# Altium schematic sheet Sheet_esp32.SchDoc
size A3
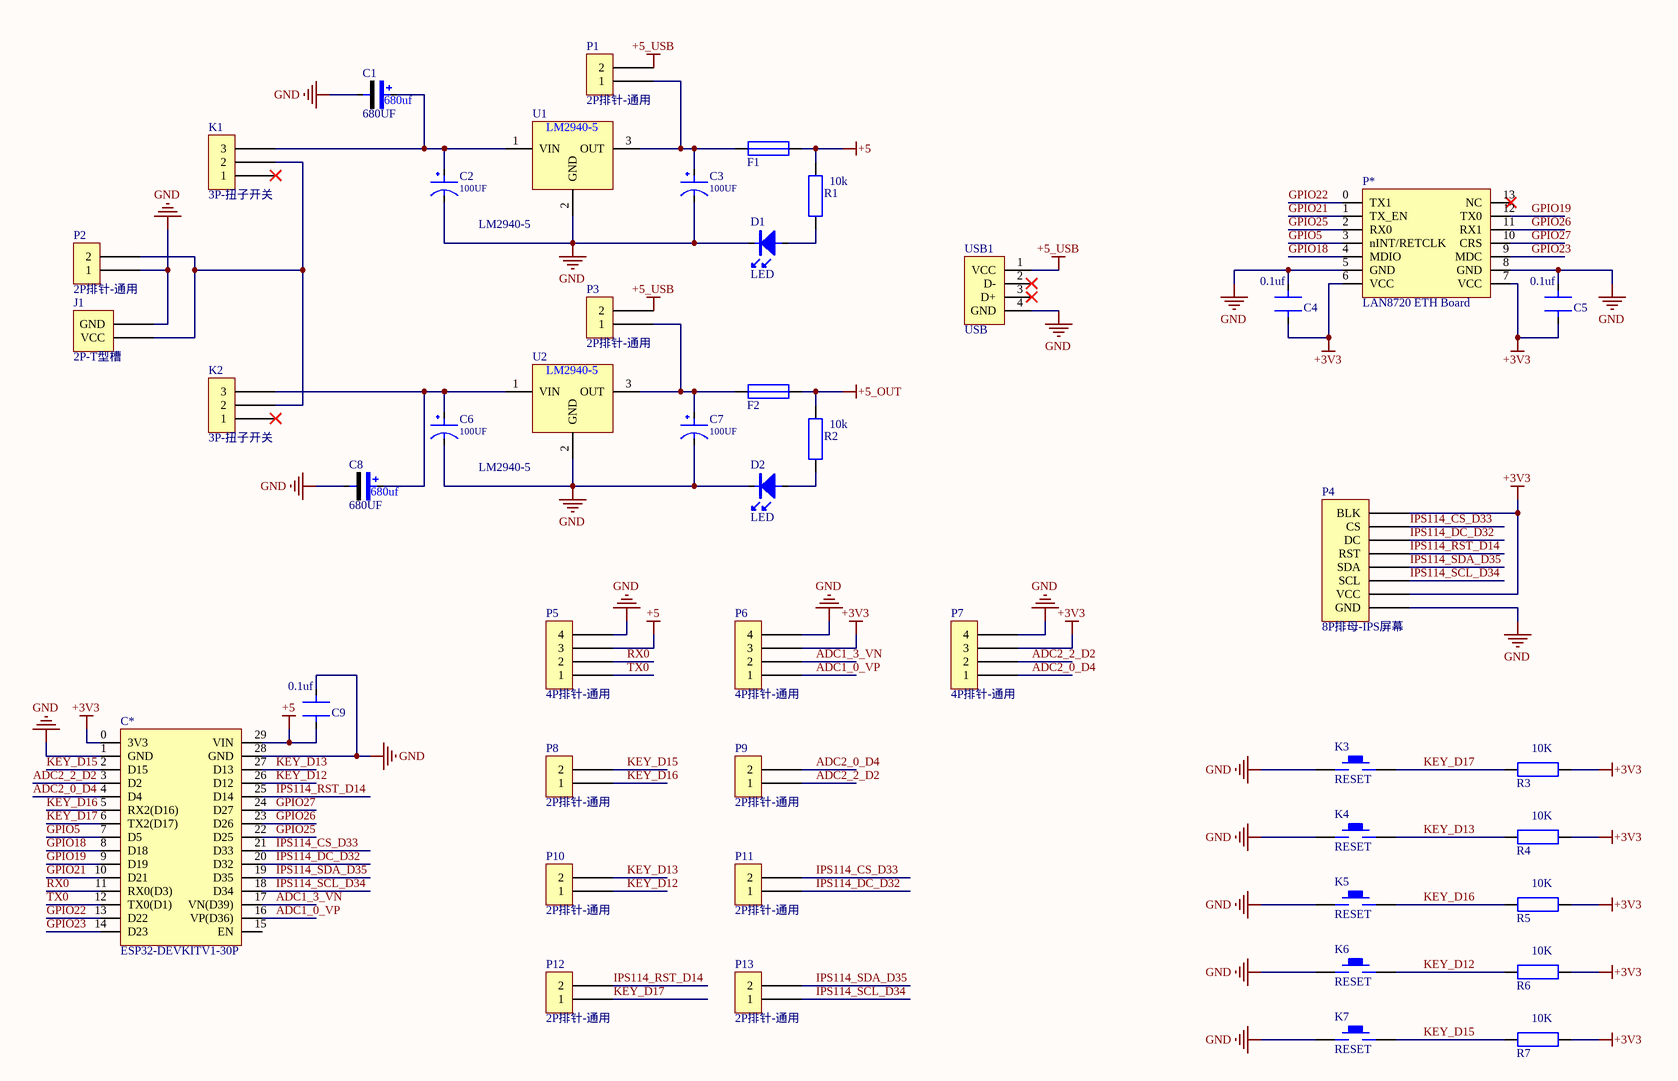
[diagram p0: Sheet_esp32.SchDoc]

## Parts
C1  680UF  [电容-直插680UF]
C2  100UF  [电容-直插680UF]
C3  100UF  [电容-直插680UF]
C4  0.1uf  [贴片0603-手工]
C5  0.1uf  [贴片0603-手工]
C6  100UF  [电容-直插680UF]
C7  100UF  [电容-直插680UF]
C8  680UF  [电容-直插680UF]
C9  0.1uf  [贴片0603-手工]
C*  ESP32-DEVKITV1-30P  [ESP32-DEVKITV1-30P]
D1  LED  [贴片0805-手工]
D2  LED  [贴片0805-手工]
F1  保险丝-通用  [贴片0805-手工]  (value not drawn)
F2  保险丝-通用  [贴片0805-手工]  (value not drawn)
J1  2P-T型槽  [T型槽-通用]
K1  3P-扭子开关  [扭子开关-直插通用]
K2  3P-扭子开关  [扭子开关-直插通用]
K3  RESET  [贴片按键-复位]
K4  RESET  [贴片按键-复位]
K5  RESET  [贴片按键-复位]
K6  RESET  [贴片按键-复位]
K7  RESET  [贴片按键-复位]
P1  2P排针-通用  [2p排针-通用]
P2  2P排针-通用  [2P-KF2EDGK插头]
P3  2P排针-通用  [2p排针-通用]
P4  8P排母-IPS屏幕  [8P排母-IPS屏幕]
P5  4P排针-通用  [4p排针-直插通用]
P6  4P排针-通用  [4p排针-直插通用]
P7  4P排针-通用  [4p排针-直插通用]
P8  2P排针-通用  [2p排针-通用]
P9  2P排针-通用  [2p排针-通用]
P10  2P排针-通用  [2p排针-通用]
P11  2P排针-通用  [2p排针-通用]
P12  2P排针-通用  [2p排针-通用]
P13  2P排针-通用  [2p排针-通用]
P*  LAN8720 ETH Board  [LAN8720 ETH Board]
R1  10k  [贴片0805-手工]
R2  10k  [贴片0805-手工]
R3  10K  [贴片0805-手工]
R4  10K  [贴片0805-手工]
R5  10K  [贴片0805-手工]
R6  10K  [贴片0805-手工]
R7  10K  [贴片0805-手工]
U1  LM2940-5  [3p排针-直插通用]
U2  LM2940-5  [3p排针-直插通用]
USB1  USB  [USB-A-F/P_B]

## Nets
+3V3: C4.1 C5.1 C*.0(3V3) P4.2(VCC) P4.8(BLK) P6.3 P7.3 P*.6(VCC) P*.7(VCC) R3.1 R4.1 R5.1 R6.1 R7.1
+5: C9.1 C*.29(VIN) F1.2 P5.3 R1.2
+5_OUT: F2.2 R2.2
+5_USB: P1.2 P3.2 USB1.1(VCC)
GND: C1.2 C2.2(GND) C3.2(GND) C4.2 C5.2 C6.2(GND) C7.2(GND) C8.2 C9.2 C*.1(GND) C*.28(GND) D1.2 D2.2 J1.2(GND) K3.1 K4.1 K5.1 K6.1 K7.1 P2.1 P4.1(GND) P5.4 P6.4 P7.4 P*.5(GND) P*.8(GND) U1.2(GND) U2.2(GND) USB1.4(GND)
ADC1_0_VP: C*.16(VP(D36)) P6.1
ADC1_3_VN: C*.17(VN(D39)) P6.2
ADC2_0_D4: C*.4(D4) P7.1 P9.2
ADC2_2_D2: C*.3(D2) P7.2 P9.1
GPIO5: C*.7(D5) P*.3(nINT/RETCLK)
GPIO18: C*.8(D18) P*.4(MDIO)
GPIO19: C*.9(D19) P*.12(TX0)
GPIO21: C*.10(D21) P*.1(TX_EN)
GPIO22: C*.13(D22) P*.0(TX1)
GPIO23: C*.14(D23) P*.9(MDC)
GPIO25: C*.22(D25) P*.2(RX0)
GPIO26: C*.23(D26) P*.11(RX1)
GPIO27: C*.24(D27) P*.10(CRS)
IPS114_CS_D33: C*.21(D33) P4.7(CS) P11.2
IPS114_DC_D32: C*.20(D32) P4.6(DC) P11.1
IPS114_RST_D14: C*.25(D14) P4.5(RST) P12.2
IPS114_SCL_D34: C*.18(D34) P4.3(SCL) P13.1
IPS114_SDA_D35: C*.19(D35) P4.4(SDA) P13.2
KEY_D12: C*.26(D12) K6.2 P10.1 R6.2
KEY_D13: C*.27(D13) K4.2 P10.2 R4.2
KEY_D15: C*.2(D15) K7.2 P8.2 R7.2
KEY_D16: C*.5(RX2(D16)) K5.2 P8.1 R5.2
KEY_D17: C*.6(TX2(D17)) K3.2 P12.1 R3.2
RX0: C*.11(RX0(D3)) P5.2
TX0: C*.12(TX0(D1)) P5.1
NetC1_1: C1.1 C2.1(VCC) K1.3 U1.1(VIN)
NetC3_1: C3.1(VCC) F1.1 P1.1 U1.3(OUT)
NetC6_1: C6.1(VCC) C8.1 K2.3 U2.1(VIN)
NetC7_1: C7.1(VCC) F2.1 P3.1 U2.3(OUT)
NetD1_1: D1.1 R1.1
NetD2_1: D2.1 R2.1
NetJ1_1: J1.1(VCC) K1.2 K2.2 P2.2

Not connected (* = marked no-connect by the designer): C* 15(EN); K1 1*; K2 1*; P* 13(NC)*; USB1 2(D-)* 3(D+)*

## Notes on the sheet
- (in symbol 电容-680UF) 680uf

## Library data of the parts
C1 C8 = 电容-680UF: 电源直插Capacitor
C2 C3 C6 C7 = 电容2-通用: Capacitor; Withstand Voltage: 16V
C4 C5 C9 = 电容1-通用: Capacitor; Published: 8-Jun-2000; LatestRevisionDate: 17-Jul-2002; LatestRevisionNote: Re-released for DXP Platform.; PackageReference: RAD-0.3; Publisher: Altium Limited; PackageDescription: Radial Cap, Thru-Hole; 2 Leads; 0.3 in Pin Spacing; Value: 0.1uf
D1 D2 = 电灯-通用
J1 = 2P-T型槽: 含引脚标记-电源; LatestRevisionDate: 17-Jul-2002; LatestRevisionNote: Re-released for DXP Platform.; Publisher: Altium Limited
K1 K2 = 3P-扭子开关: 中间那个是公共脚
K3-K7 = KEY-弹性复位: 按键(弹性)-复位
P4 = 8P排母-IPS屏幕: 含引脚标记
P* = LAN8720 ETH Board: LAN8720 网络模块 以太网收发器ETH RMII接口
R1-R7 = 电阻 - 通用: Resistor; Published: 8-Jun-2000; LatestRevisionDate: 17-Jul-2002; LatestRevisionNote: Re-released for DXP Platform.; PackageReference: AXIAL-0.4; Publisher: Altium Limited; PackageDescription: Axial Device, Thru-Hole; 2 Leads; 0.4 in Pin Spacing
U1 U2 = LM2940-5: LM2940-5.0 五伏稳压 - 和LM1117不一样，中间脚是公共地
USB1 = USB_G
F1 F2 = 保险丝-通用: Published: 8-Jun-2000; LatestRevisionDate: 17-Jul-2002; LatestRevisionNote: Re-released for DXP Platform.; PackageReference: AXIAL-0.4; Publisher: Altium Limited; PackageDescription: Axial Device, Thru-Hole; 2 Leads; 0.4 in Pin Spacing
P1-P3 P8-P13 = 2P排针-通用: LatestRevisionDate: 17-Jul-2002; LatestRevisionNote: Re-released for DXP Platform.; Publisher: Altium Limited